# EAGLE design bbb_connection_board (EAGLE 7.2.0)
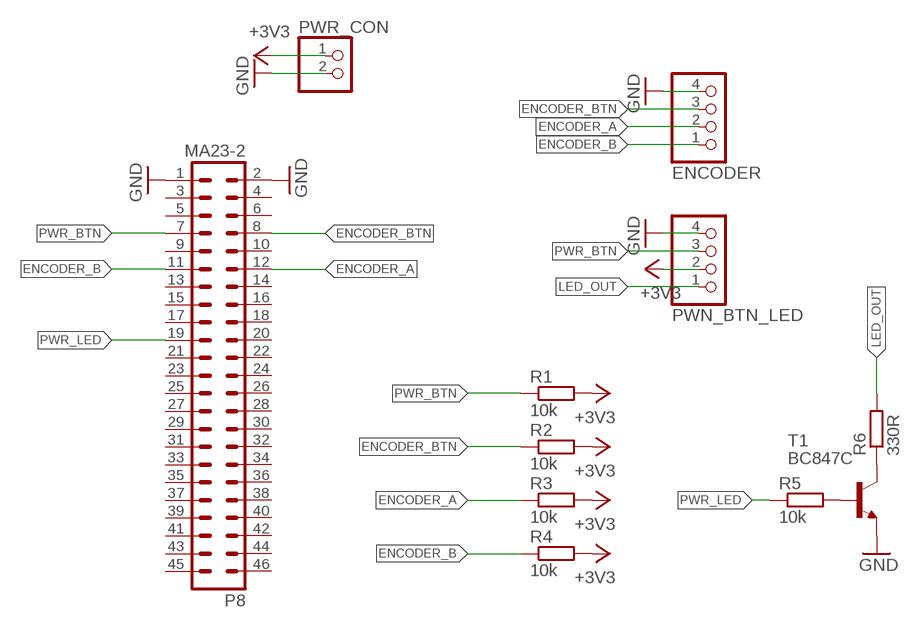
[diagram p0: schematic, sheet 1]

## Parts
ENCODER  PINHD-1X4/90  [1X04/90]
P8  MA23-2  [MA23-2]
PWN_BTN_LED  PINHD-1X4/90  [1X04/90]
PWR_CON  PINHD-1X2/90  [1X02/90]
R1  10k  R-EU_R0805  [R0805]
R2  10k  R-EU_R0805  [R0805]
R3  10k  R-EU_R0805  [R0805]
R4  10k  R-EU_R0805  [R0805]
R5  10k  R-EU_R0805  [R0805]
R6  330R  R-EU_R0805  [R0805]
T1  BC847C  BC847A-NPN-SOT23-BEC  [SOT23-BEC]

## Nets
+3V3: PWN_BTN_LED.2 PWR_CON.1 R1.2 R2.2 R3.2 R4.2
ENCODER_A: ENCODER.2 P8.12 R3.1
ENCODER_B: ENCODER.1 P8.11 R4.1
ENCODER_BTN: ENCODER.3 P8.8 R2.1
GND: ENCODER.4 P8.1 P8.2 PWN_BTN_LED.4 PWR_CON.2 T1.E
LED_OUT: PWN_BTN_LED.1 R6.2
N$1: R5.2 T1.B
N$3: R6.1 T1.C
PWR_BTN: P8.7 PWN_BTN_LED.3 R1.1
PWR_LED: P8.19 R5.1
Unconnected: P8.3 P8.4 P8.5 P8.6 P8.9 P8.10 P8.13 P8.14 P8.15 P8.16 P8.17 P8.18 P8.20 P8.21 P8.22 P8.23 P8.24 P8.25 P8.26 P8.27 P8.28 P8.29 P8.30 P8.31 P8.32 P8.33 P8.34 P8.35 P8.36 P8.37 P8.38 P8.39 P8.40 P8.41 P8.42 P8.43 P8.44 P8.45 P8.46

## Library data of the parts
ENCODER PWN_BTN_LED = pinhead:PINHD-1X4: PIN HEADER
P8 = con-lstb-mod:MA23-2
PWR_CON = pinhead:PINHD-1X2: PIN HEADER
R1-R6 = rcl:R-EU_: RESISTOR, European symbol
T1 = transistor:*-NPN-: NPN Transistror BF959 corrected 2008.03.06

## Board
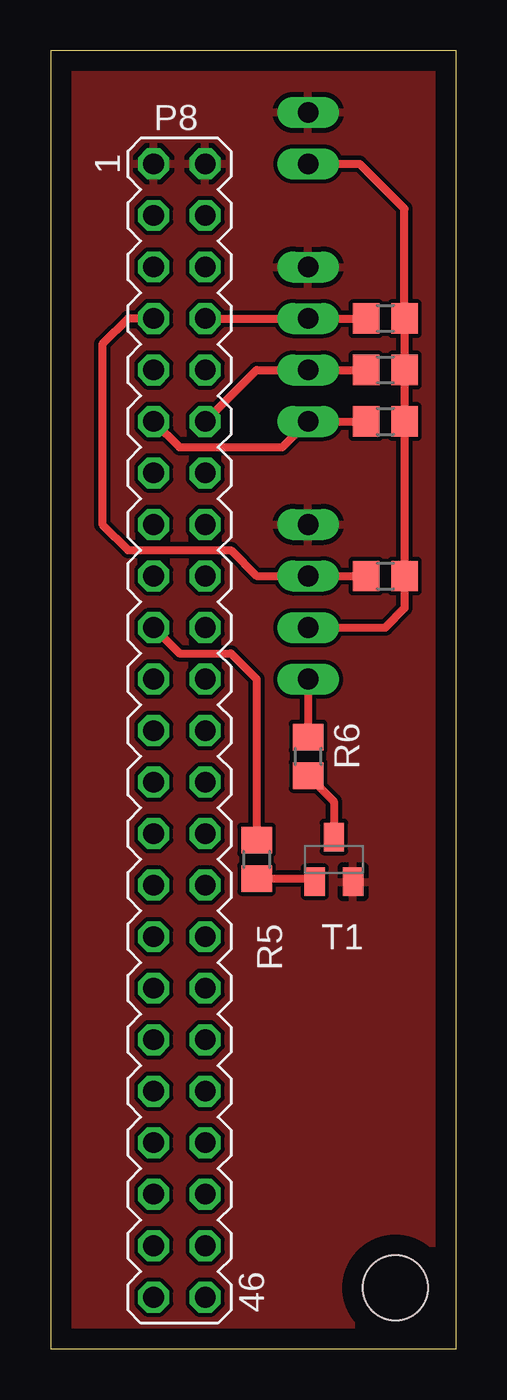
[diagram p1: board, top side]
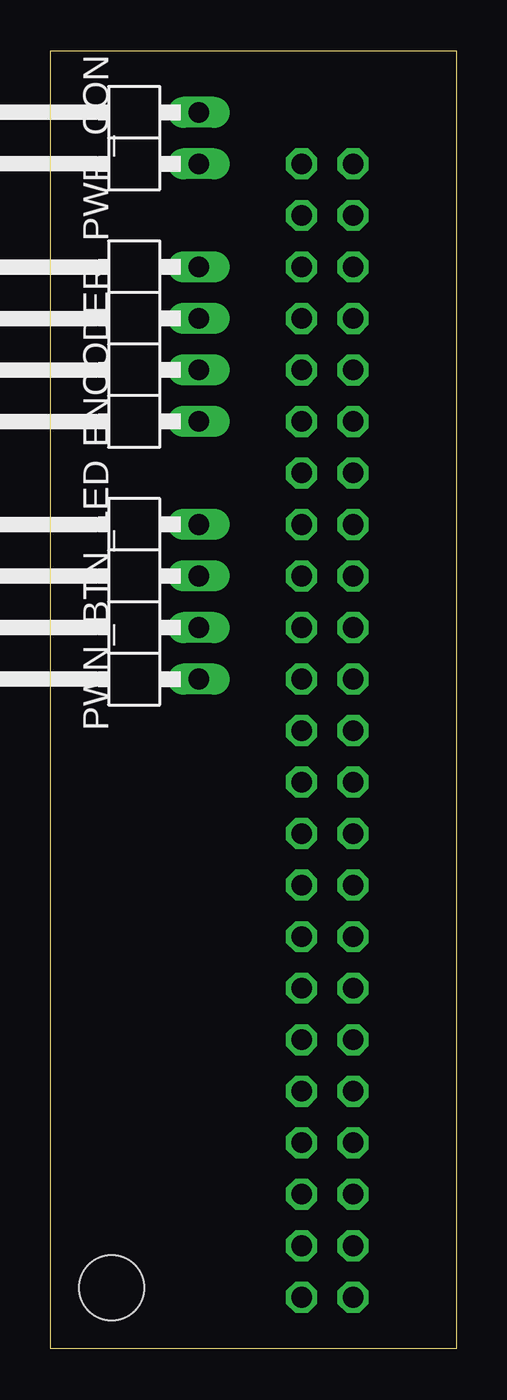
[diagram p2: board, bottom side, seen from below]

Size 20 x 64 mm. Coordinates in mm from the lower left corner, seen from the top.
Outline: 0,0 20,0 20,64 0,64 0,0
Copper layers (1*16): Top 0.035mm / dielectric 1.5mm / Bottom 0.035mm
Design rules "default": minimum track width 10mil, minimum drill 24mil, track to track 8mil, track to pad 8mil, pad to pad 8mil, via to via 8mil, smd to smd 8mil, copper to edge 40mil, drill to drill 8mil, minimum pad ring 10mil, minimum via ring 8mil, stop-mask expansion 4mil, vias tented up to drill 0mil, thermal gap 10mil
Holes 3.2 mm at 17,3

### Footprints (pad centres in the part's own frame; a part is rotated, then mirrored left to right if it is on the bottom)
1X04/90 = drill 1.016 long: 1 -3.81,-3.81; 2 -1.27,-3.81; 3 1.27,-3.81; 4 3.81,-3.81
MA23-2 = drill 1.016 octagon: 1 0,0; 2 0,2.54; 3 2.54,0; 4 2.54,2.54; 5 5.08,0; 6 5.08,2.54; 7 7.62,0; 8 7.62,2.54; 9 10.16,0; 10 10.16,2.54; 11 12.7,0; 12 12.7,2.54; 13 15.24,0; 14 15.24,2.54; 15 17.78,0; 16 17.78,2.54; 17 20.32,0; 18 20.32,2.54; 19 22.86,0; 20 22.86,2.54; 21 25.4,0; 22 25.4,2.54; 23 27.94,0; 24 27.94,2.54; 25 30.48,0; 26 30.48,2.54; 27 33.02,0; 28 33.02,2.54; 29 35.56,0; 30 35.56,2.54; 31 38.1,0; 32 38.1,2.54; 33 40.64,0; 34 40.64,2.54; 35 43.18,0; 36 43.18,2.54; 37 45.72,0; 38 45.72,2.54; 39 48.26,0; 40 48.26,2.54; 41 50.8,0; 42 50.8,2.54; 43 53.34,0; 44 53.34,2.54; 45 55.88,0; 46 55.88,2.54
1X02/90 = drill 1.016 long: 1 -1.27,-3.81; 2 1.27,-3.81
R0805 = smd 1.3 x 1.5: 1 -0.95,0; 2 0.95,0
SOT23-BEC = smd 1 x 1.4: B -0.95,-1.1; C 0,1.1; E 0.95,-1.1

### Placement (x,y rotation side)
ENCODER  16.51,49.53 90 bottom
P8  5.08,58.42 270 top
PWN_BTN_LED  16.51,36.83 90 bottom
PWR_CON  16.51,59.69 90 bottom
R1  16.51,38.1 0 top
R2  16.51,50.8 0 top
R3  16.51,48.26 0 top
R4  16.51,45.72 0 top
R5  10.16,24.13 270 top
R6  12.7,29.21 90 top
T1  13.97,24.13 0 top

### Tracks (layer width: path | path; a pad name or v marks a point on that pad's centre or on a via)
+3V3
  Top 0.406: PWR_CON.1 15.24,58.42 17.46,56.2 R2.2 R3.2 R4.2 R1.2 17.46,36.51 16.51,35.56 PWN_BTN_LED.2
ENCODER_A
  Top 0.406: P8.12 10.16,48.26 ENCODER.2 R3.1
ENCODER_B
  Top 0.406: P8.11 6.35,44.45 11.43,44.45 ENCODER.1 R4.1
ENCODER_BTN
  Top 0.406: P8.8 ENCODER.3 R2.1
GND
  pour Top: -1.27,64.77 21.59,64.77 21.59,-1.27 -1.27,-1.27
LED_OUT
  Top 0.406: PWN_BTN_LED.1 R6.2
N$1
  Top 0.406: R5.2 12.87,23.18 T1.B
N$3
  Top 0.406: R6.1 13.97,26.99 T1.C
PWR_BTN
  Top 0.406: P8.7 3.81,50.8 2.54,49.53 2.54,40.64 3.81,39.37 8.89,39.37 10.16,38.1 PWN_BTN_LED.3 R1.1
PWR_LED
  Top 0.406: P8.19 6.35,34.29 8.89,34.29 10.16,33.02 R5.1